# Altium project Led_4x7.PrjPcb
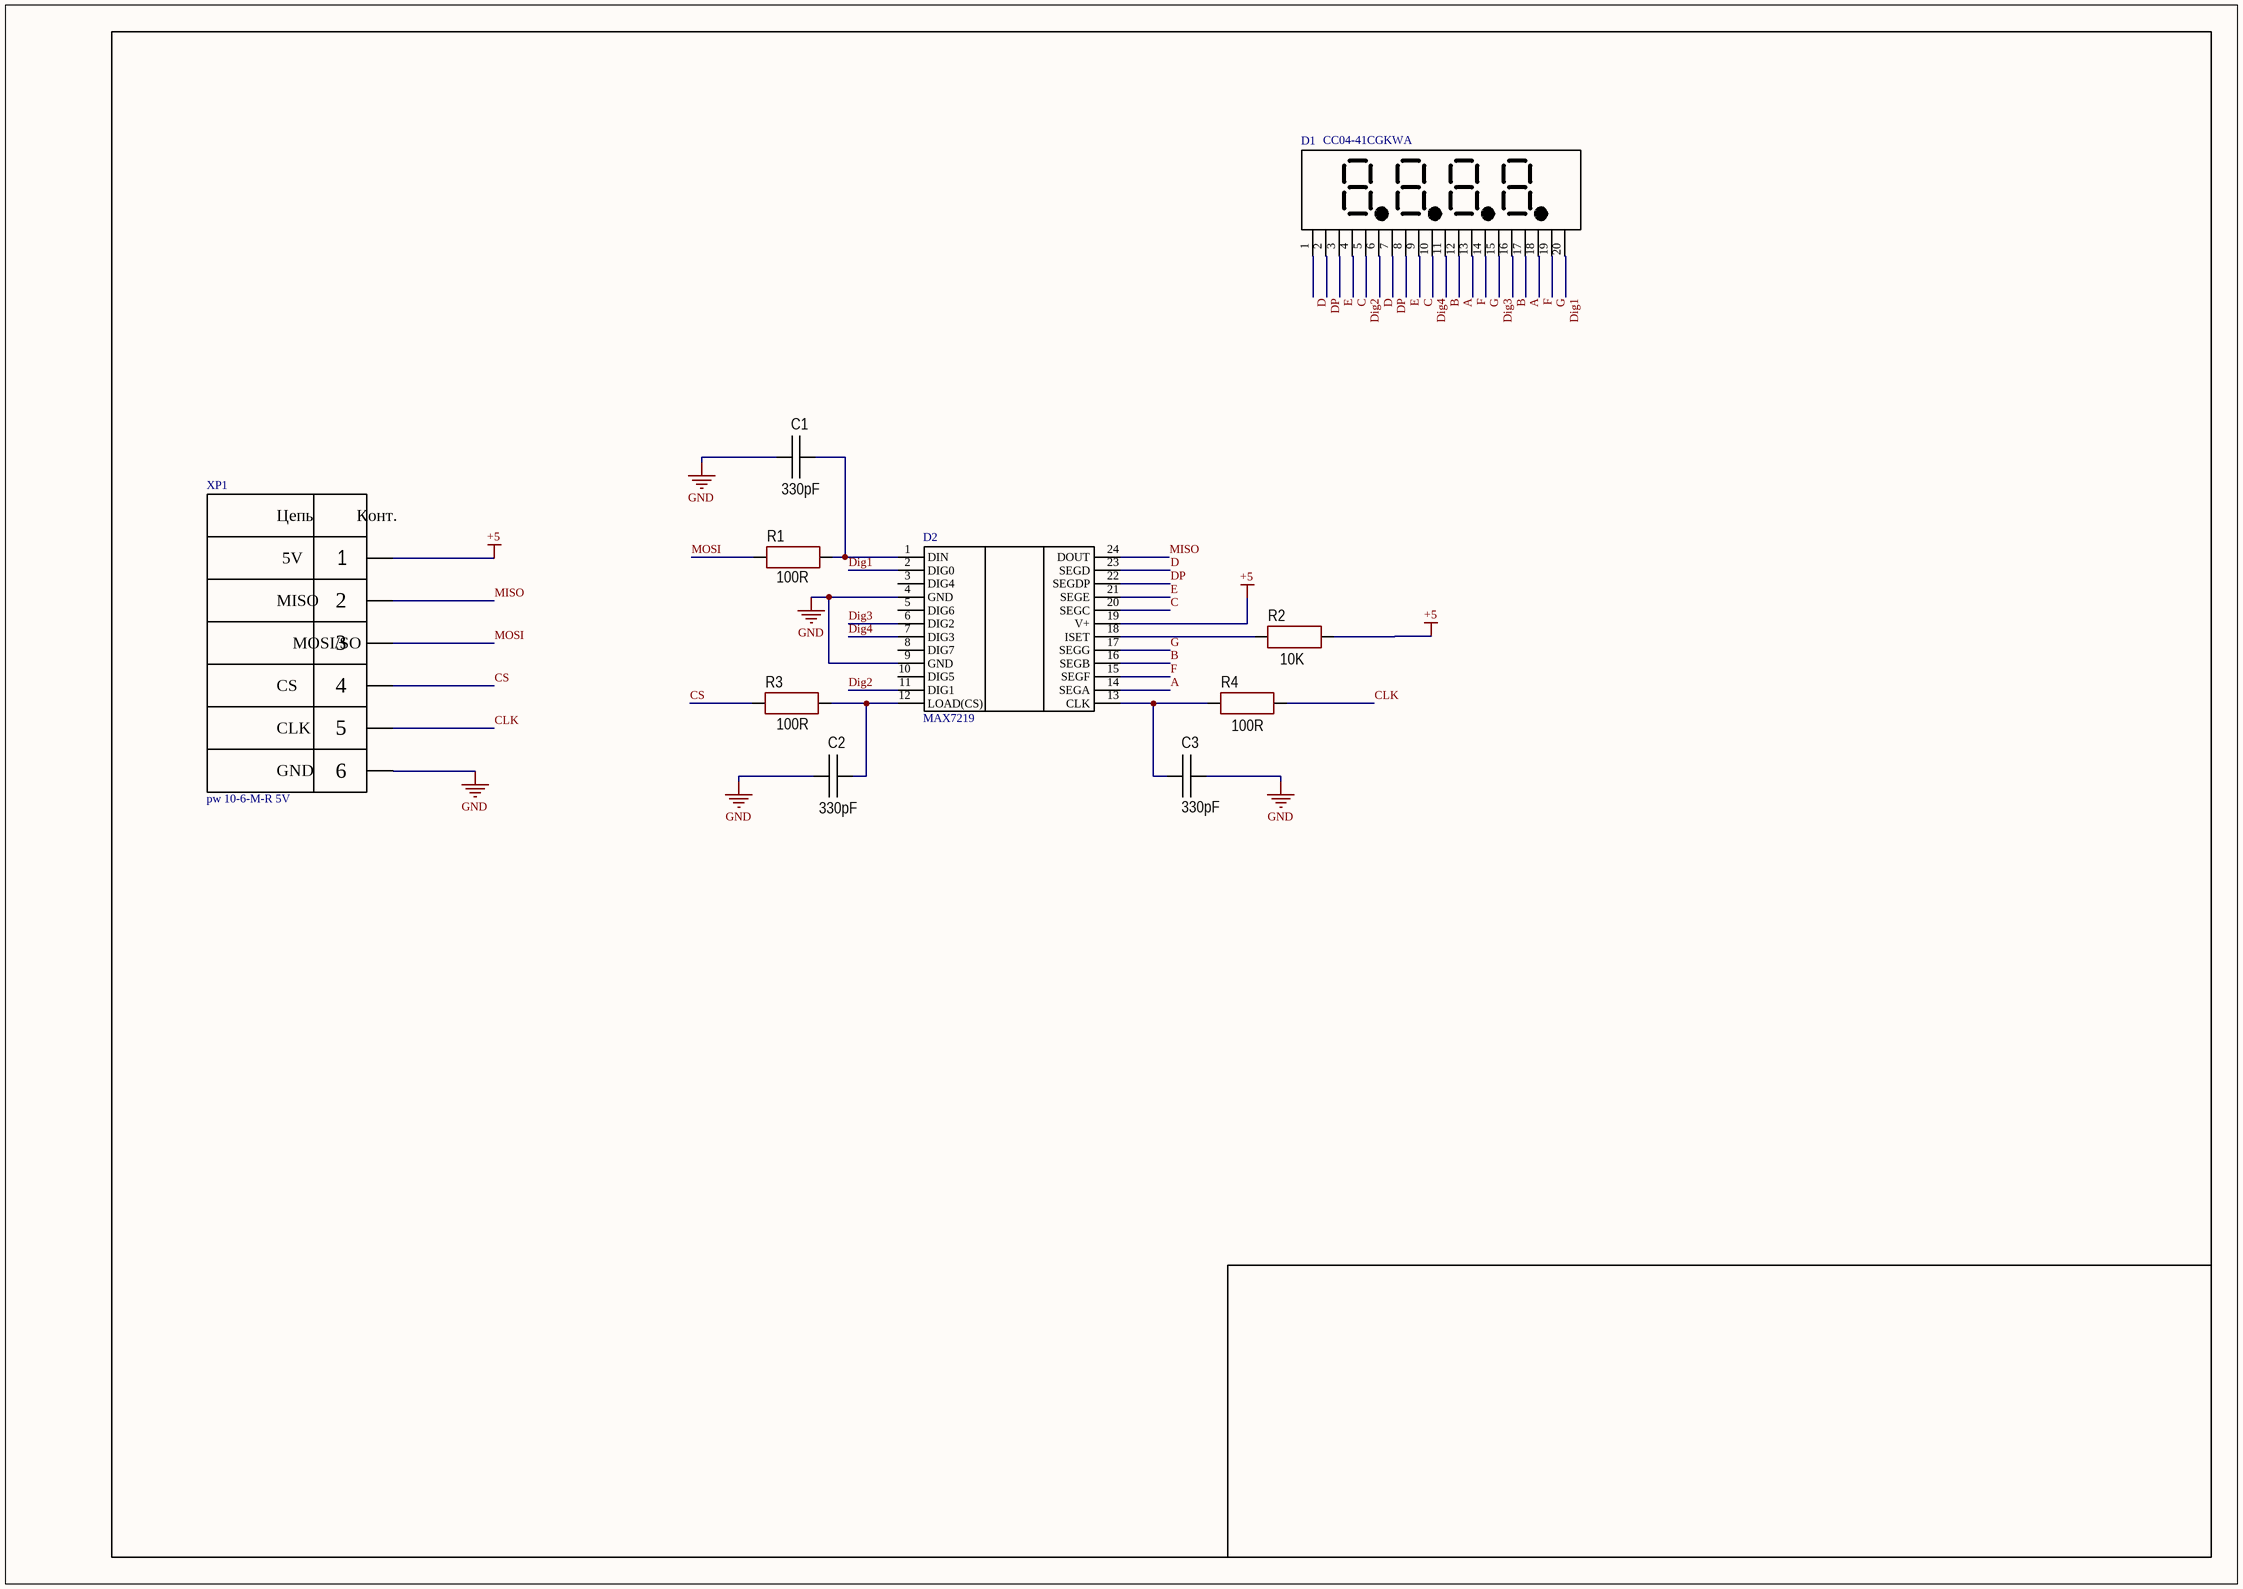
[diagram p0: LED_SEMISEGMENT.SchDoc]
1 sheet, 10 parts. Net scope: global (net labels, ports and power ports of the same name join across sheets).
Board file: PCB1.PcbDoc

## Sheet LED_SEMISEGMENT.SchDoc
size 420 x 297 mm

### Parts
C1  value 330pF  [CAP: 0805]
C2  value 330pF  [CAP: 0805]
C3  value 330pF  [CAP: 0805]
D1  CC04-41CGKWA  [7 segment x4]
D2  MAX7219  [SOIC127P1030X265-24N]
R1  value 100R  [RES: 0805]
R2  value 10K  [RES: 0805]
R3  value 100R  [RES: 0805]
R4  value 100R  [RES: 0805]
XP1  pw 10-6-M-R 5V  [PW 10-6-M]

### Nets
+5: D2.19(V+) R2.2 XP1.1
GND: C1.2 C2.2 C3.2 D2.4(GND) D2.9(GND) XP1.6
A: D1.12 D1.17 D2.14(SEGA)
B: D1.11 D1.16 D2.16(SEGB)
C: D1.4 D1.9 D2.20(SEGC)
CLK: R4.2 XP1.5
CS: R3.1 XP1.4
D: D1.1 D1.6 D2.23(SEGD)
Dig1: D1.20 D2.2(DIG0)
Dig2: D1.5 D2.11(DIG1)
Dig3: D1.15 D2.6(DIG2)
Dig4: D1.10 D2.7(DIG3)
DP: D1.2 D1.7 D2.22(SEGDP)
E: D1.3 D1.8 D2.21(SEGE)
F: D1.13 D1.18 D2.15(SEGF)
G: D1.14 D1.19 D2.17(SEGG)
MISO: D2.24(DOUT) XP1.2
MOSI: R1.1 XP1.3
NetC1_1: C1.1 D2.1(DIN) R1.2
NetC2_1: C2.1 D2.12(LOAD(CS)) R3.2
NetC3_1: C3.1 D2.13(CLK) R4.1
NetD2_18: D2.18(ISET) R2.1

Not connected (* = marked no-connect by the designer): D2 3(DIG4) 5(DIG6) 8(DIG7) 10(DIG5)

### Notes on the sheet
- (in symbol pw 10-6-M-R 5V) Цепь; Конт.; 5V; MISO; MOSI/SO; CS; CLK; GND

### Library data of the parts
C1-C3 = Ceramic_0805: ValueManufacturerPartNumber: Ceramic capacitor, 330pF, X7R, , , 0805,; TypeCapacitor: Ceramic capacitor; TypeDielectric: X7R; Package: 0805
D1 = LED_7x4: Manufacture: KingBright; HelpURL: https://www.chipdip.ru/product1/8001938892
R1 R4 = Resistor_0805: ValueManufacturerPartNumber: , 100R, , 0805, ,; Package: 0805
R2 = Resistor_0805: ValueManufacturerPartNumber: , 10K, , 0805, ,; Package: 0805
R3 = Resistor_0805: Package: 0805